# EAGLE design tlc5940 (EAGLE 5.11)
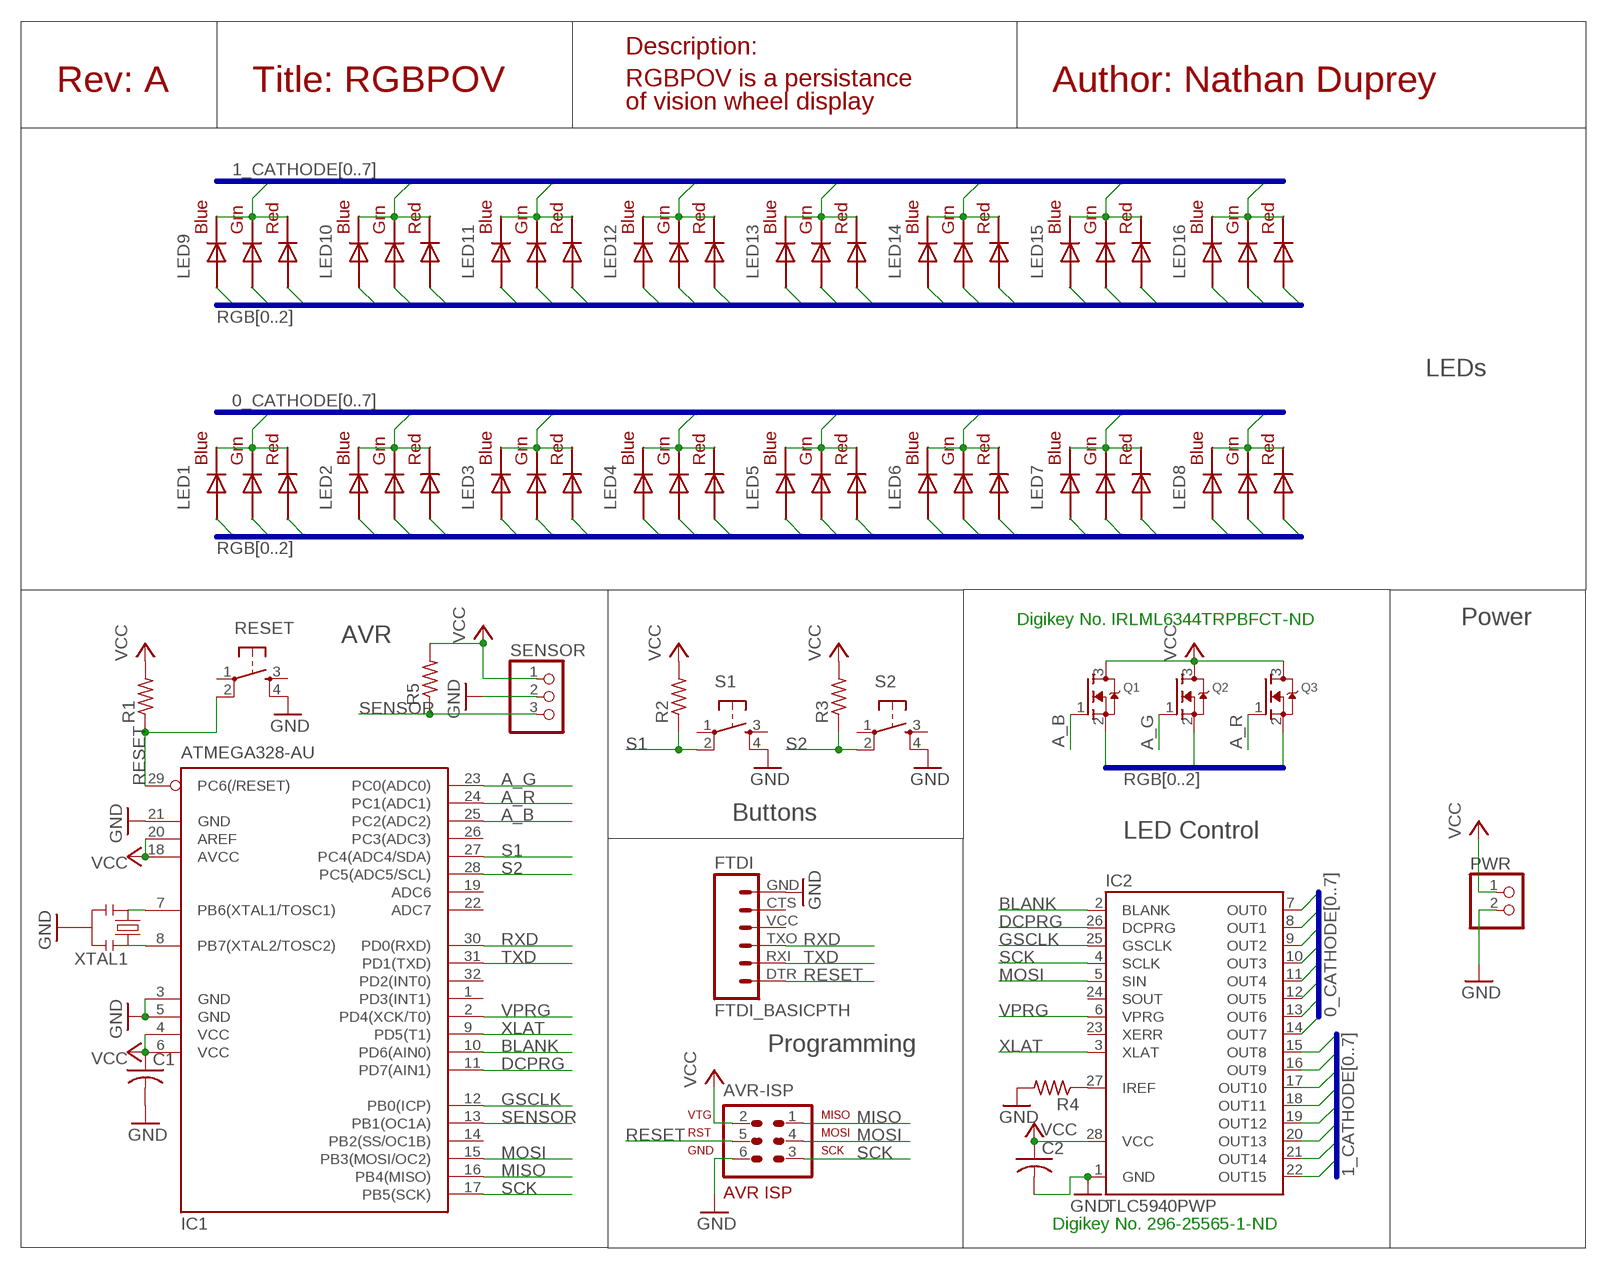
[diagram p0: schematic, sheet 1]

## Parts
AVR-ISP  AVR-ISP-6  [AVR-ISP-6]
C1  C-USC0805K  [C0805K]
C2  C-USC0805K  [C0805K]
FTDI  FTDI_BASICPTH  [FTDI_BASIC]
IC1  ATMEGA328-AU  MEGA8-AI  [TQFP32-08]
IC2  TLC5940PWP  [HTSSOP28PWP]
LED1  RGBLED5050  [RGBLED5050]
LED2  RGBLED5050  [RGBLED5050]
LED3  RGBLED5050  [RGBLED5050]
LED4  RGBLED5050  [RGBLED5050]
LED5  RGBLED5050  [RGBLED5050]
LED6  RGBLED5050  [RGBLED5050]
LED7  RGBLED5050  [RGBLED5050]
LED8  RGBLED5050  [RGBLED5050]
LED9  RGBLED5050  [RGBLED5050]
LED10  RGBLED5050  [RGBLED5050]
LED11  RGBLED5050  [RGBLED5050]
LED12  RGBLED5050  [RGBLED5050]
LED13  RGBLED5050  [RGBLED5050]
LED14  RGBLED5050  [RGBLED5050]
LED15  RGBLED5050  [RGBLED5050]
LED16  RGBLED5050  [RGBLED5050]
PWR  PINHD-1X2  [1X02]
Q1  MOSFET-NREFLOW  [SOT23]
Q2  MOSFET-NREFLOW  [SOT23]
Q3  MOSFET-NREFLOW  [SOT23]
R1  R-US_R0805  [R0805]
R2  R-US_R0805  [R0805]
R3  R-US_R0805  [R0805]
R4  R-US_R0805  [R0805]
R5  R-US_R0805  [R0805]
RESET  TAC_SWITCHPTH  [TACTILE-PTH]
S1  TAC_SWITCHPTH  [TACTILE-PTH]
S2  TAC_SWITCHPTH  [TACTILE-PTH]
SENSOR  PINHD-1X3  [1X03]
XTAL1  RESONATORPTH  [RESONATOR-PTH]

## Nets
0_CATHODE0: IC2.7(OUT0) LED1.4(BLUE_C) LED1.5(RED_C) LED1.6(GREEN_C)
0_CATHODE1: IC2.8(OUT1) LED2.4(BLUE_C) LED2.5(RED_C) LED2.6(GREEN_C)
0_CATHODE2: IC2.9(OUT2) LED3.4(BLUE_C) LED3.5(RED_C) LED3.6(GREEN_C)
0_CATHODE3: IC2.10(OUT3) LED4.4(BLUE_C) LED4.5(RED_C) LED4.6(GREEN_C)
0_CATHODE4: IC2.11(OUT4) LED5.4(BLUE_C) LED5.5(RED_C) LED5.6(GREEN_C)
0_CATHODE5: IC2.12(OUT5) LED6.4(BLUE_C) LED6.5(RED_C) LED6.6(GREEN_C)
0_CATHODE6: IC2.13(OUT6) LED7.4(BLUE_C) LED7.5(RED_C) LED7.6(GREEN_C)
0_CATHODE7: IC2.14(OUT7) LED8.4(BLUE_C) LED8.5(RED_C) LED8.6(GREEN_C)
1_CATHODE0: IC2.15(OUT8) LED9.4(BLUE_C) LED9.5(RED_C) LED9.6(GREEN_C)
1_CATHODE1: IC2.16(OUT9) LED10.4(BLUE_C) LED10.5(RED_C) LED10.6(GREEN_C)
1_CATHODE2: IC2.17(OUT10) LED11.4(BLUE_C) LED11.5(RED_C) LED11.6(GREEN_C)
1_CATHODE3: IC2.18(OUT11) LED12.4(BLUE_C) LED12.5(RED_C) LED12.6(GREEN_C)
1_CATHODE4: IC2.19(OUT12) LED13.4(BLUE_C) LED13.5(RED_C) LED13.6(GREEN_C)
1_CATHODE5: IC2.20(OUT13) LED14.4(BLUE_C) LED14.5(RED_C) LED14.6(GREEN_C)
1_CATHODE6: IC2.21(OUT14) LED15.4(BLUE_C) LED15.5(RED_C) LED15.6(GREEN_C)
1_CATHODE7: IC2.22(OUT15) LED16.4(BLUE_C) LED16.5(RED_C) LED16.6(GREEN_C)
A_B: IC1.25(PC2(ADC2)) Q1.1(G)
A_G: IC1.23(PC0(ADC0)) Q2.1(G)
A_R: IC1.24(PC1(ADC1)) Q3.1(G)
BLANK: IC1.10(PD6(AIN0)) IC2.2(BLANK)
DCPRG: IC1.11(PD7(AIN1)) IC2.26(DCPRG)
GND: AVR-ISP.6 C1.2 C2.2 FTDI.GND IC1.3(GND) IC1.5(GND) IC1.21(GND) IC2.1(GND) PWR.2 R4.2 RESET.4 S1.4 S2.4 SENSOR.2 XTAL1.2
GSCLK: IC1.12(PB0(ICP)) IC2.25(GSCLK)
MISO: AVR-ISP.1 IC1.16(PB4(MISO))
MOSI: AVR-ISP.4 IC1.15(PB3(MOSI/OC2)) IC2.5(SIN)
N$1: IC1.7(PB6(XTAL1/TOSC1)) XTAL1.1
N$2: IC1.8(PB7(XTAL2/TOSC2)) XTAL1.3
N$3: IC2.27(IREF) R4.1
RESET: AVR-ISP.5 FTDI.DTR IC1.29(PC6(/RESET)) R1.1 RESET.2
RGB0: LED1.3(BLUE_A) LED2.3(BLUE_A) LED3.3(BLUE_A) LED4.3(BLUE_A) LED5.3(BLUE_A) LED6.3(BLUE_A) LED7.3(BLUE_A) LED8.3(BLUE_A) LED9.3(BLUE_A) LED10.3(BLUE_A) LED11.3(BLUE_A) LED12.3(BLUE_A) LED13.3(BLUE_A) LED14.3(BLUE_A) LED15.3(BLUE_A) LED16.3(BLUE_A) Q1.2(S)
RGB1: LED1.1(GREEN_A) LED2.1(GREEN_A) LED3.1(GREEN_A) LED4.1(GREEN_A) LED5.1(GREEN_A) LED6.1(GREEN_A) LED7.1(GREEN_A) LED8.1(GREEN_A) LED9.1(GREEN_A) LED10.1(GREEN_A) LED11.1(GREEN_A) LED12.1(GREEN_A) LED13.1(GREEN_A) LED14.1(GREEN_A) LED15.1(GREEN_A) LED16.1(GREEN_A) Q2.2(S)
RGB2: LED1.2(RED_A) LED2.2(RED_A) LED3.2(RED_A) LED4.2(RED_A) LED5.2(RED_A) LED6.2(RED_A) LED7.2(RED_A) LED8.2(RED_A) LED9.2(RED_A) LED10.2(RED_A) LED11.2(RED_A) LED12.2(RED_A) LED13.2(RED_A) LED14.2(RED_A) LED15.2(RED_A) LED16.2(RED_A) Q3.2(S)
RXD: FTDI.TXO IC1.30(PD0(RXD))
S1: IC1.27(PC4(ADC4/SDA)) R2.1 S1.2
S2: IC1.28(PC5(ADC5/SCL)) R3.1 S2.2
SCK: AVR-ISP.3 IC1.17(PB5(SCK)) IC2.4(SCLK)
SENSOR: IC1.13(PB1(OC1A)) R5.1 SENSOR.3
TXD: FTDI.RXI IC1.31(PD1(TXD))
VCC: AVR-ISP.2 C1.1 C2.1 IC1.4(VCC) IC1.6(VCC) IC1.18(AVCC) IC1.20(AREF) IC2.28(VCC) PWR.1 Q1.3(D) Q2.3(D) Q3.3(D) R1.2 R2.2 R3.2 R5.2 SENSOR.1
VPRG: IC1.2(PD4(XCK/T0)) IC2.6(VPRG)
XLAT: IC1.9(PD5(T1)) IC2.3(XLAT)
Unconnected: FTDI.CTS FTDI.VCC IC1.1(PD3(INT1)) IC1.14(PB2(SS/OC1B)) IC1.19(ADC6) IC1.22(ADC7) IC1.26(PC3(ADC3)) IC1.32(PD2(INT0)) IC2.23(XERR) IC2.24(SOUT) RESET.1 RESET.3 S1.1 S1.3 S2.1 S2.3

## Buses
RGB[0..2]
0_CATHODE[0..7]
1_CATHODE[0..7]

## Notes on the sheet
- Description:
- Rev: A | Title: RGBPOV | RGBPOV is a persistance | Author: Nathan Duprey
- of vision wheel display
- LEDs
- Digikey No. IRLML6344TRPBFCT-ND | Power
- AVR
- Buttons
- LED Control
- Programming
- Digikey No. 296-25565-1-ND

## Library data of the parts
AVR-ISP = avr-6:AVR-ISP-6: AVR ISP-6 Serial Programming Header
C1 C2 = adafruit:C-US: CAPACITOR, American symbol
FTDI = SparkFun:FTDI_BASIC: FTDI Basic: 3.3V and 5V
IC1 = atmel:MEGA8: MICROCONTROLLER 8 Kbytes FLASH, 1 kbytes SRAM, 512 bytes EEPROM, USART, 6-channel 10 bit ADC, 2-channel 8 bit ADC Pin compatible with Atmega48, ATMega88, ATMega168 Source: avr.lbr; MPN: ATMEGA8-16AU; OC_FARNELL: 9171371; OC_NEWARK: 73M8863
IC2 = texas:TLC5940
LED1-LED16 = adafruit:RGBLED: For 5050 RGB LEDs, the order of the LEDs may vary from one manufacturer to another!
PWR = pinhead:PINHD-1X2: PIN HEADER
Q1-Q3 = adafruit:MOSFET-N: N-Channel Mosfet 2N7002E - 60V 260mA SOT23 [Digikey: 2N7002ET1GOSTR-ND] - REEL BSH103 - 30V 850mA SOT23 [Digikey: 568-5013-1-ND]
R1-R5 = adafruit:R-US_: RESISTOR, American symbol
RESET S1 S2 = SparkFun:TAC_SWITCH: Momentary Switch Button commonly used for reset or general input. Spark Fun Electronics SKU : COM-00097
SENSOR = pinhead:PINHD-1X3: PIN HEADER
XTAL1 = SparkFun:RESONATOR: Resonator Small SMD resonator. This is the itty bitty 10/20MHz resonators with built in caps. CSTCE10M0G55 and CSTCE20M0V53. Footprint has been reviewed closely but hasn't been tested yet.

## Board
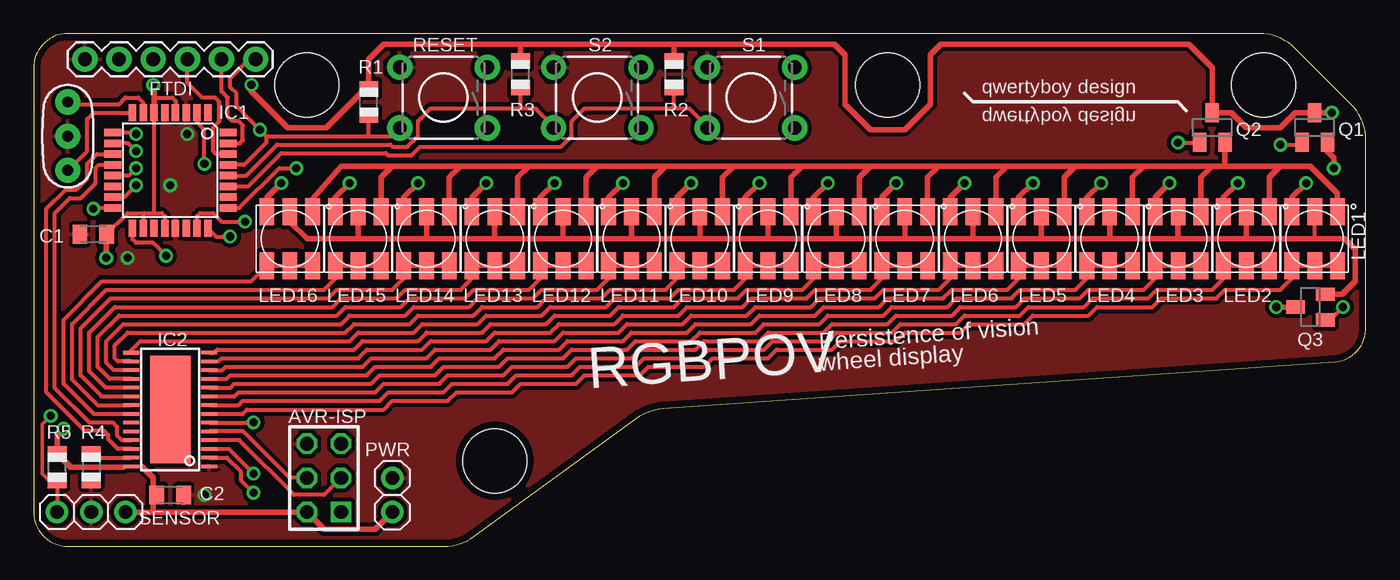
[diagram p1: board, top side]
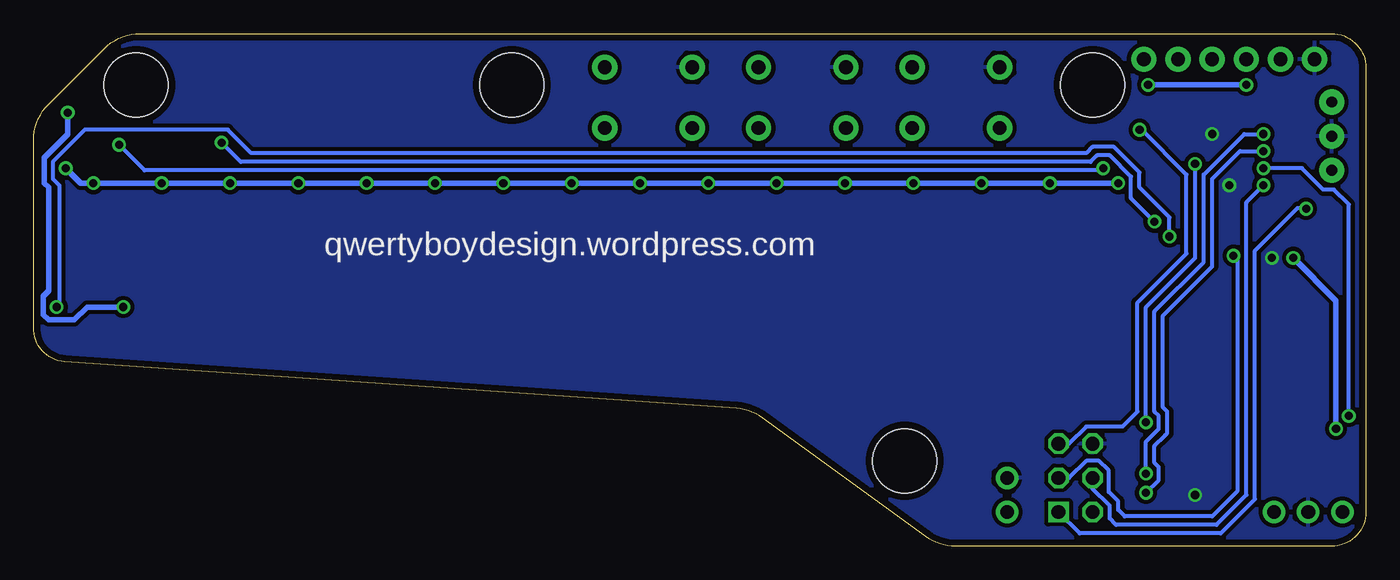
[diagram p2: board, bottom side, seen from below]

Size 99.06 x 38.1 mm. Coordinates in mm from the lower left corner, seen from the top.
Outline: 30.51,0 arc36 32.75,0.73 44.84,9.52 arc-32 46.81,10.24 96.79,13.72 arc86 99.06,16.25 99.06,30.17 arc45 97.94,32.87 93.83,36.98 arc45 91.13,38.1 2.54,38.1 arc90 0,35.56 0,2.54 arc90 2.54,0 30.51,0
Copper layers (1*16): Top 0.0356mm / dielectric 1.5011mm / Bottom 0.0356mm
Design rules "batch_pcb *": minimum track width 9mil, minimum drill 20mil, track to track 9mil, track to pad 9mil, pad to pad 9mil, via to via 9mil, smd to smd 9mil, copper to edge 20mil, drill to drill 9mil, minimum pad ring 8mil, minimum via ring 8mil, stop-mask expansion 4mil, vias tented up to drill 24mil, thermal gap 10mil
Holes 4.76 mm at 91.44,34.29 63.5,34.29 20.32,34.29 34.29,6.35
tRestrict: 19 lines
bRestrict: 15 lines

### Footprints (pad centres in the part's own frame; a part is rotated, then mirrored left to right if it is on the bottom)
AVR-ISP-6 = drill 1.016 square: 1 -2.54,-1.27 | drill 1.016 octagon: 2 -2.54,1.27; 3 0,-1.27; 4 0,1.27; 5 2.54,-1.27; 6 2.54,1.27
C0805K = smd 1.1 x 1.4: 1 -1,0; 2 1,0
FTDI_BASIC = drill 1.016 pad 1.88 round: CTS 10.16,0; DTR 0,0; GND 12.7,0; RXI 2.54,0; TXO 5.08,0; VCC 7.62,0
TQFP32-08 = smd 1.27 x 0.559: 1 -4.293,2.8; 2 -4.293,2; 3 -4.293,1.2; 4 -4.293,0.4; 5 -4.293,-0.4; 6 -4.293,-1.2; 7 -4.293,-2; 8 -4.293,-2.8; 17 4.293,-2.8; 18 4.293,-2; 19 4.293,-1.2; 20 4.293,-0.4; 21 4.293,0.4; 22 4.293,1.2; 23 4.293,2; 24 4.293,2.8 | smd 0.559 x 1.27: 9 -2.8,-4.293; 10 -2,-4.293; 11 -1.2,-4.293; 12 -0.4,-4.293; 13 0.4,-4.293; 14 1.2,-4.293; 15 2,-4.293; 16 2.8,-4.293; 25 2.8,4.293; 26 2,4.293; 27 1.2,4.293; 28 0.4,4.293; 29 -0.4,4.293; 30 -1.2,4.293; 31 -2,4.293; 32 -2.8,4.293
HTSSOP28PWP = smd 0.27 x 1.2: 1 -4.225,-2.901; 2 -3.575,-2.9; 3 -2.925,-2.9; 4 -2.275,-2.9; 5 -1.625,-2.9; 6 -0.975,-2.9; 7 -0.325,-2.9; 8 0.325,-2.9; 9 0.975,-2.9; 10 1.625,-2.9; 11 2.275,-2.9; 12 2.925,-2.9; 13 3.575,-2.9; 14 4.227,-2.9; 15 4.225,2.9; 16 3.575,2.9; 17 2.925,2.9; 18 2.275,2.9; 19 1.625,2.9; 20 0.975,2.9; 21 0.325,2.9; 22 -0.325,2.9; 23 -0.975,2.9; 24 -1.625,2.9; 25 -2.275,2.9; 26 -2.925,2.9; 27 -3.575,2.9; 28 -4.226,2.901 | smd 8 x 3: EXP 0,0
RGBLED5050 = smd 2 x 1.1: 1 -2,1.7; 2 -2,0; 3 -2,-1.7; 4 2,-1.7; 5 2,0; 6 2,1.7
1X02 = drill 1.016 pad 1.676 round: 1 -1.27,0; 2 1.27,0
SOT23 = smd 1 x 1.4: 1 -0.95,-1.1; 2 0.95,-1.1; 3 0,1.1
R0805 = smd 1.1 x 1.4: 1 -1,0; 2 1,0
TACTILE-PTH = drill 1.016 pad 1.88 round: 1 -3.251,2.261; 2 3.251,2.261; 3 -3.251,-2.261; 4 3.251,-2.261
1X03 = drill 1.016 pad 1.676 round: 1 -2.54,0; 2 0,0; 3 2.54,0
RESONATOR-PTH = drill 0.8 pad 1.88 round: 1 -2.54,0; 2 0,0; 3 2.54,0

### Placement (x,y rotation side)
AVR-ISP  21.59,5.08 90 top
C1  4.45,23.18 180 top
C2  10.16,3.81 0 top
FTDI  16.51,36.2 180 top
IC1  10.16,27.94 270 top
IC2  10.16,10.16 90 top
LED1  95.25,22.86 270 top
LED2  90.17,22.86 270 top
LED3  85.09,22.86 270 top
LED4  80.01,22.86 270 top
LED5  74.93,22.86 270 top
LED6  69.85,22.86 270 top
LED7  64.77,22.86 270 top
LED8  59.69,22.86 270 top
LED9  54.61,22.86 270 top
LED10  49.53,22.86 270 top
LED11  44.45,22.86 270 top
LED12  39.37,22.86 270 top
LED13  34.29,22.86 270 top
LED14  29.21,22.86 270 top
LED15  24.13,22.86 270 top
LED16  19.05,22.86 270 top
PWR  26.67,3.81 90 top
Q1  95.25,31.11 0 top
Q2  87.63,31.11 0 top
Q3  94.93,17.78 90 top
R1  24.92,33.02 90 top
R2  47.62,35.08 90 top
R3  36.2,35.08 90 top
R4  4.29,5.87 270 top
R5  1.75,5.87 90 top
RESET  30.48,33.34 180 top
S1  53.34,33.34 180 top
S2  41.91,33.34 180 top
SENSOR  4.29,2.54 180 top
U$1  [QWERTYBOY_DESIGN_LOGO]  77.47,33.02 0 bottom
XTAL1  2.54,30.48 270 top

### Tracks (layer width: path | path; a pad name or v marks a point on that pad's centre or on a via)
0_CATHODE0
  Top 0.305: IC2.7 15.55,9.84 15.88,10.16 26.04,10.16 26.67,10.79 30.8,10.79 31.43,11.43 35.56,11.43 36.2,12.06 40.32,12.06 40.96,12.7 45.09,12.7 45.72,13.34 49.85,13.34 50.48,13.97 54.61,13.97 55.24,14.61 59.37,14.61 60.01,15.24 64.14,15.24 64.77,15.88 68.9,15.88 69.53,16.51 73.66,16.51 74.3,17.14 78.42,17.14 79.06,17.78 83.19,17.78 83.82,18.41 87.95,18.41 88.58,19.05 92.71,19.05 93.98,20.32 93.98,20.43 LED1.4 LED1.5 LED1.6
0_CATHODE1
  Top 0.305: IC2.8 15.25,10.48 15.56,10.79 25.72,10.79 26.35,11.43 30.48,11.43 31.11,12.06 35.24,12.06 35.88,12.7 40.01,12.7 40.64,13.34 44.77,13.34 45.4,13.97 49.53,13.97 50.16,14.61 54.29,14.61 54.93,15.24 59.05,15.24 59.69,15.88 63.82,15.88 64.45,16.51 68.58,16.51 69.22,17.14 73.34,17.14 73.98,17.78 78.11,17.78 78.74,18.41 82.87,18.41 83.5,19.05 87.63,19.05 88.9,20.32 88.9,20.43 LED2.4 LED2.5 LED2.6
0_CATHODE2
  Top 0.305: IC2.9 14.95,11.13 15.24,11.43 25.4,11.43 26.04,12.06 30.16,12.06 30.8,12.7 34.92,12.7 35.56,13.34 39.69,13.34 40.32,13.97 44.45,13.97 45.09,14.61 49.21,14.61 49.85,15.24 53.98,15.24 54.61,15.88 58.74,15.88 59.37,16.51 63.5,16.51 64.14,17.14 68.26,17.14 68.9,17.78 73.03,17.78 73.66,18.41 77.79,18.41 78.42,19.05 82.55,19.05 83.82,20.32 83.82,20.43 LED3.4 LED3.5 LED3.6
0_CATHODE3
  Top 0.305: IC2.10 14.64,11.79 14.92,12.06 25.08,12.06 25.72,12.7 29.84,12.7 30.48,13.34 34.61,13.34 35.24,13.97 39.37,13.97 40.01,14.61 44.13,14.61 44.77,15.24 48.9,15.24 49.53,15.88 53.66,15.88 54.29,16.51 58.42,16.51 59.05,17.14 63.18,17.14 63.82,17.78 67.94,17.78 68.58,18.41 72.71,18.41 73.34,19.05 77.47,19.05 78.74,20.32 78.74,20.43 LED4.4 LED4.5 LED4.6
0_CATHODE4
  Top 0.305: IC2.11 14.34,12.44 14.61,12.7 24.77,12.7 25.4,13.34 29.53,13.34 30.16,13.97 34.29,13.97 34.92,14.61 39.05,14.61 39.69,15.24 43.81,15.24 44.45,15.88 48.58,15.88 49.21,16.51 53.34,16.51 53.98,17.14 58.1,17.14 58.74,17.78 62.87,17.78 63.5,18.41 67.63,18.41 68.26,19.05 72.39,19.05 73.66,20.32 73.66,20.43 LED5.4 LED5.5 LED5.6
0_CATHODE5
  Top 0.305: IC2.12 14.04,13.09 14.29,13.34 24.45,13.34 25.08,13.97 29.21,13.97 29.84,14.61 33.97,14.61 34.61,15.24 38.73,15.24 39.37,15.88 43.5,15.88 44.13,16.51 48.26,16.51 48.9,17.14 53.02,17.14 53.66,17.78 57.78,17.78 58.42,18.41 62.55,18.41 63.18,19.05 67.31,19.05 68.58,20.32 68.58,20.43 LED6.4 LED6.5 LED6.6
0_CATHODE6
  Top 0.305: IC2.13 13.73,13.73 13.97,13.97 24.13,13.97 24.77,14.61 28.89,14.61 29.53,15.24 33.66,15.24 34.29,15.88 38.42,15.88 39.05,16.51 43.18,16.51 43.81,17.14 47.94,17.14 48.58,17.78 52.7,17.78 53.34,18.41 57.47,18.41 58.1,19.05 62.23,19.05 63.5,20.32 63.5,20.43 LED7.4 LED7.5 LED7.6
0_CATHODE7
  Top 0.305: IC2.14 13.43,14.39 13.65,14.61 23.81,14.61 24.45,15.24 28.57,15.24 29.21,15.88 33.34,15.88 33.97,16.51 38.1,16.51 38.73,17.14 42.86,17.14 43.5,17.78 47.62,17.78 48.26,18.41 52.39,18.41 53.02,19.05 57.15,19.05 58.42,20.32 58.42,20.43 LED8.4 LED8.5 LED8.6
1_CATHODE0
  Top 0.305: IC2.15 7.26,14.56 7.94,15.24 23.5,15.24 24.13,15.88 28.26,15.88 28.89,16.51 33.02,16.51 33.66,17.14 37.78,17.14 38.42,17.78 42.55,17.78 43.18,18.41 47.31,18.41 47.94,19.05 52.07,19.05 53.34,20.32 53.34,20.43 LED9.4 LED9.5 LED9.6
1_CATHODE1
  Top 0.305: IC2.16 6.27,13.73 6.03,13.97 6.03,14.92 6.99,15.88 23.18,15.88 23.81,16.51 27.94,16.51 28.57,17.14 32.7,17.14 33.34,17.78 37.47,17.78 38.1,18.41 42.23,18.41 42.86,19.05 46.99,19.05 48.26,20.32 48.26,20.43 LED10.4 LED10.5 LED10.6
1_CATHODE2
  Top 0.305: IC2.17 5.96,13.09 5.4,13.65 5.4,15.24 6.67,16.51 22.86,16.51 23.5,17.14 27.62,17.14 28.26,17.78 32.38,17.78 33.02,18.41 37.15,18.41 37.78,19.05 41.91,19.05 43.18,20.32 43.18,20.43 LED11.4 LED11.5 LED11.6
1_CATHODE3
  Top 0.305: IC2.18 5.66,12.44 4.76,13.34 4.76,15.56 6.35,17.14 22.54,17.14 23.18,17.78 27.3,17.78 27.94,18.41 32.07,18.41 32.7,19.05 36.83,19.05 38.1,20.32 38.1,20.43 LED12.4 LED12.5 LED12.6
1_CATHODE4
  Top 0.305: IC2.19 5.36,11.79 4.13,13.02 4.13,15.88 6.03,17.78 22.23,17.78 22.86,18.41 26.99,18.41 27.62,19.05 31.75,19.05 33.02,20.32 33.02,20.43 LED13.4 LED13.5 LED13.6
1_CATHODE5
  Top 0.305: IC2.20 5.06,11.13 3.49,12.7 3.49,16.19 5.71,18.41 21.91,18.41 22.54,19.05 26.67,19.05 27.94,20.32 27.94,20.43 LED14.4 LED14.5 LED14.6
1_CATHODE6
  Top 0.305: IC2.21 4.75,10.48 2.86,12.38 2.86,16.51 5.4,19.05 21.59,19.05 22.86,20.32 22.86,20.43 LED15.4 LED15.5 LED15.6
1_CATHODE7
  Top 0.305: IC2.22 4.45,9.84 2.22,12.06 2.22,16.83 5.08,19.68 16.18,19.68 LED16.4 LED16.5 LED16.6
A_B  (via drill 0.6 pad 1.02)
  Top 0.305: IC1.25 15.3,25.14 18.26,28.1 v19.53,28.1 | v92.71,29.84 94.13,29.84 Q1.1
  Bottom 0.305: v92.71,29.84 90.81,27.94 19.68,27.94 v19.53,28.1 | v19.53,28.1
A_G  (via drill 0.6 pad 1.02)
  Top 0.305: IC1.23 12.16,24.54 12.38,24.77 13.34,24.77 13.65,24.45 13.97,24.13 v15.72,24.13 | v85.09,30 86.67,30 Q2.1
  Bottom 0.305: 83.66,28.57 20.48,28.57 20,29.05 19.05,29.05 17.46,27.46 17.46,25.88 v15.72,24.13 | v15.72,24.13 | 83.66,28.57 | 83.66,28.57 v85.09,30
A_R  (via drill 0.6 pad 1.02)
  Top 0.305: v14.61,23.02 13.59,23.02 IC1.24 | Q3.1 96.41,16.83 v97.36,17.78
  Bottom 0.305: v14.61,23.02 14.61,24.45 16.83,26.67 16.83,27.78 18.73,29.69 20.32,29.69 20.8,29.21 82.87,29.21 84.61,30.96 95.25,30.96 97.63,28.57 97.63,27.3 97.16,26.83 97.16,17.98 v97.36,17.78
BLANK  (via drill 0.6 pad 1.02)
  Top 0.305: IC2.2 14.37,6.58 15.4,5.56 15.4,4.92 v16.35,3.97 | IC1.10 7.05,29.94 v7.62,29.37
  Bottom 0.305: v16.35,3.97 15.4,4.92 15.4,5.87 15.72,6.19 15.72,7.46 14.92,8.26 | 14.92,8.26 | 14.92,8.26 14.76,8.41 14.76,10 15.08,10.32 15.08,17.14 11.43,20.8 11.43,27.3 9.37,29.37 v7.62,29.37
DCPRG
  Top 0.305: IC1.11 4.69,29.14 3.97,28.42 3.97,27.3 3.17,26.51 2.38,26.51 0.95,25.08 0.95,11.43 3.81,8.57 5.24,8.57 5.56,8.26 5.56,7.94 6.26,7.24 IC2.26
GND  (via drill 0.6 pad 1.02)
  other vias: 12.7,3.81 10.16,26.83 11.43,30.64 6.99,21.43
  pour Top (isolate 0.305): 0,0 99.06,0 99.06,38.1 0,38.1
  pour Bottom (isolate 0.305): 0,0 99.06,0 99.06,38.1 0,38.1
GSCLK
  Top 0.305: IC1.12 4.84,28.34 4.6,28.1 4.6,26.99 3.49,25.88 2.7,25.88 1.59,24.77 1.59,11.75 4.13,9.21 5.87,9.21 6.19,8.89 6.19,8.26 6.56,7.88 IC2.25
MISO  (via drill 0.6 pad 1.02)
  Top 0.305: IC1.16 4.5,25.14 v4.45,25.08
  Bottom 0.305: AVR-ISP.1 21.27,0.95 10.79,0.95 8.26,3.49 8.26,21.96 5.08,25.14 4.5,25.14 v4.45,25.08
MOSI  (via drill 0.6 pad 1.02)
  Top 0.305: IC2.5 15.6,8.54 19.05,5.08 AVR-ISP.4 | IC1.15 6.73,25.94 v7.62,26.83
  Bottom 0.305: AVR-ISP.4 20.32,4.29 19.05,3.02 19.05,2.06 18.57,1.59 11.11,1.59 8.89,3.81 8.89,25.56 v7.62,26.83
N$1
  Top 0.305: IC1.7 8.16,32.96 7.78,33.34 6.83,33.34 6.35,32.86 2.7,32.86 XTAL1.1
N$2
  Top 0.305: XTAL1.3 3.97,29.37 3.97,31.75 4.45,32.23 IC1.8
N$3
  Top 0.305: IC2.27 4.58,6.58 R4.1
RESET  (via drill 0.6 pad 1.02)
  Top 0.305: IC1.29 15.64,28.34 17.3,30 17.3,30.48 | 24.92,30.48 26.63,30.48 RESET.2 | 24.92,30.48 R1.1 | FTDI.DTR 16.03,36.2 14.61,34.77 14.61,34.13 15.08,33.66 15.08,32.7 16.19,31.59 | 16.19,31.59 | 16.19,31.59 v16.83,30.96 17.3,30.48 | 17.3,30.48 24.92,30.48
  Bottom 0.305: AVR-ISP.5 22.07,7.62 20.8,8.89 18.1,8.89 16.99,10 16.99,18.1 13.34,21.75 13.34,27.62 16.67,30.96 v16.83,30.96
RGB0  (via drill 0.6 pad 1.02)
  Top 0.305: Q1.2
  Top 0.406: LED16.3 17.35,25.92 v18.41,26.99 | LED15.3 22.43,25.92 v23.5,26.99 | LED14.3 27.51,25.92 v28.57,26.99 | LED13.3 32.59,25.92 v33.66,26.99 | LED12.3 37.67,25.92 v38.73,26.99 | LED11.3 42.75,25.92 v43.81,26.99 | LED10.3 47.83,25.92 v48.9,26.99 | LED9.3 52.91,25.92 v53.98,26.99 | LED8.3 57.99,25.92 v59.05,26.99 | LED7.3 63.07,25.92 v64.14,26.99 | LED6.3 68.15,25.92 v69.22,26.99 | LED5.3 73.23,25.92 v74.3,26.99 | LED4.3 78.31,25.92 v79.38,26.99 | LED3.3 83.39,25.92 v84.45,26.99 | LED2.3 88.47,25.92 v89.53,26.99 | LED1.3 93.55,25.92 v94.61,26.99 | v96.68,28.1 96.68,28.89 96.2,29.37 Q1.2
  Bottom 0.406: v18.41,26.99 v23.5,26.99 v28.57,26.99 v33.66,26.99 v38.73,26.99 v43.81,26.99 v48.9,26.99 v53.98,26.99 v59.05,26.99 v64.14,26.99 v69.22,26.99 v74.3,26.99 v79.38,26.99 v84.45,26.99 v89.53,26.99 v94.61,26.99 95.57,26.99 v96.68,28.1
RGB1
  Top 0.305: LED16.1 20.75,25.83
  Top 0.406: 20.75,25.83 22.86,28.26 26.67,28.26 | 26.67,28.26 31.75,28.26 | 31.75,28.26 36.83,28.26 | 36.83,28.26 41.91,28.26 | 41.91,28.26 46.99,28.26 | 46.99,28.26 52.07,28.26 | 52.07,28.26 57.15,28.26 | 57.15,28.26 62.23,28.26 | 62.23,28.26 67.31,28.26 | 67.31,28.26 72.39,28.26 | 72.39,28.26 77.47,28.26 | 77.47,28.26 82.55,28.26 | 82.55,28.26 87.63,28.26 | 87.63,28.26 88.58,28.26 | 88.58,28.26 92.71,28.26 | 92.71,28.26 94.93,28.26 96.95,26.24 LED1.1 | LED15.1 25.83,27.42 26.67,28.26 | LED14.1 30.91,27.42 31.75,28.26 | LED13.1 35.99,27.42 36.83,28.26 | LED11.1 46.15,27.42 46.99,28.26 | LED10.1 51.23,27.42 52.07,28.26 | LED9.1 56.31,27.42 57.15,28.26 | LED8.1 61.39,27.42 62.23,28.26 | LED7.1 66.47,27.42 67.31,28.26 | LED6.1 71.55,27.42 72.39,28.26 | LED5.1 76.63,27.42 77.47,28.26 | LED4.1 81.71,27.42 82.55,28.26 | LED12.1 41.07,27.42 41.91,28.26 | LED3.1 86.79,27.42 87.63,28.26 | LED2.1 91.87,27.42 92.71,28.26 | Q2.2 88.58,28.26
RGB2
  Top 0.305: 95.25,24.13 95.25,23.02 95.41,22.86
  Top 0.406: LED16.2 19.05,24.13 20.32,22.86 24.13,22.86 | 24.13,22.86 29.21,22.86 | 29.21,22.86 34.29,22.86 | 34.29,22.86 39.37,22.86 | 39.37,22.86 44.45,22.86 | 44.45,22.86 49.53,22.86 | 49.53,22.86 54.61,22.86 | 54.61,22.86 59.69,22.86 | 59.69,22.86 64.77,22.86 | 64.77,22.86 69.85,22.86 | 69.85,22.86 74.93,22.86 | 74.93,22.86 80.01,22.86 | 80.01,22.86 85.09,22.86 | 85.09,22.86 90.17,22.86 | 95.25,24.13 LED1.2 | 90.17,22.86 LED2.2 | 85.09,22.86 LED3.2 | 80.01,22.86 LED4.2 | 74.93,22.86 LED5.2 | 69.85,22.86 LED6.2 | 64.77,22.86 LED7.2 | 59.69,22.86 LED8.2 | 54.61,22.86 LED9.2 | 49.53,22.86 LED10.2 | 44.45,22.86 LED11.2 | 39.37,22.86 LED12.2 | 34.29,22.86 LED13.2 | 29.21,22.86 LED14.2 | 24.13,22.86 LED15.2 | 90.17,22.86 95.41,22.86 97.47,22.86 98.27,22.07 98.27,19.68 97.31,18.73 Q3.2
RXD
  Top 0.305: IC1.30 13.56,29.14 13.34,29.37 13.34,31.11 13.81,31.59 13.81,33.02 13.49,33.34 12.54,33.34 11.43,34.45 FTDI.TXO
S1
  Top 0.305: S1.2 50.09,31.19 48.74,32.54 47.62,32.54 | 47.62,32.54 40.96,32.54 40.01,31.59 | 40.01,31.59 | 40.01,31.59 40.01,30.48 39.21,29.69 28.73,29.69 28.1,29.05 26.35,29.05 26.19,29.21 18.41,29.21 15.95,26.74 IC1.27 | 47.62,32.54 R2.1
S2
  Top 0.305: S2.2 38.66,31.19 37.47,32.38 | 37.47,32.38 | 37.47,32.38 37.31,32.54 36.2,32.54 | 36.2,32.54 29.53,32.54 28.73,31.75 | 28.73,31.75 | 28.73,31.75 28.57,31.59 28.57,30.48 27.78,29.69 26.67,29.69 26.51,29.84 18.1,29.84 15.79,27.54 IC1.28 | 36.2,32.54 R3.1
SCK  (via drill 0.6 pad 1.02)
  Top 0.305: IC2.4 15.29,7.88 19.37,3.81 21.59,3.81 AVR-ISP.3 | IC1.17 7.36,22.8 7.62,22.54 8.89,22.54 v9.84,21.59
  Bottom 0.305: v9.84,21.59 9.53,21.27 9.53,4.13 11.43,2.22 17.94,2.22 18.41,2.7 18.41,3.33 19.13,4.05 19.13,5.64 19.84,6.35 20.8,6.35 22.07,5.08 AVR-ISP.3
SENSOR  (via drill 0.6 pad 1.02)
  Top 0.254: R5.1 1.16,4.87 0.64,5.4 0.64,9.05 v1.27,9.68
  Top 0.305: R5.1 SENSOR.3 | IC1.13 7.06,27.54 v7.62,28.1
  Bottom 0.305: v7.62,28.1 4.76,28.1 3.17,26.51 2.38,26.51 1.27,25.4 v1.27,9.68
TXD
  Top 0.305: IC1.31 15.34,29.94 15.56,30.16 15.56,31.27 15.24,31.59 14.76,31.59 14.45,31.91 14.45,33.34 13.97,33.81 FTDI.RXI
VCC  (via drill 0.6 pad 1.02)
  Top 0.305: 8.04,5.93 IC2.28 6.73,5.93 6.67,5.87 | 8.89,4.08 C2.1 | IC1.18 8.16,24.67 8.26,24.77 | IC1.20 9.76,24.53 9.53,24.77 8.89,24.77 | 8.26,24.77 8.89,24.77 | C1.1 5.45,23.23 6.99,24.77 8.26,24.77 | IC1.4 10.56,33.1 10.32,33.34 8.96,33.34 | IC1.6 8.96,24.84 8.89,24.77 | 26.51,37.31
  Top 0.406: 8.04,5.93 8.89,5.08 8.89,4.08 | 36.2,37.31 26.51,37.31 26.04,37.31 24.92,36.2 R1.2 24.88,33.97 24.61,33.97 21.75,31.11 18.89,31.11 16.19,33.81 v16.19,34.29 | 36.2,37.31 R3.2 | 36.2,37.31 47.62,37.31 | 47.62,37.31 R2.2 | v92.39,17.78 Q3.3 | v96.52,32.23 95.26,32.23 Q1.3 93.81,32.22 92.71,31.11 90.17,31.11 89.06,32.23 87.64,32.23 Q2.3 87.63,35.56 85.88,37.31 67.47,37.31 66.67,36.51 66.67,32.86 66.52,32.7 | 6.67,5.87 2.75,5.87 R5.2 1.75,8.26 v2.22,8.73 | PWR.1 25.4,1.27 21.59,1.27 AVR-ISP.2 8.89,2.54 | C2.1 8.89,3.54 8.89,2.54 | v5.4,21.43 5.4,23.13 C1.1 | 8.89,2.54 SENSOR.1 | IC1.6 8.96,33.34 8.96,34.22 v8.89,34.29 | 47.62,37.31 59.53,37.31 60.33,36.51 60.33,32.86 62.23,30.96 64.77,30.96 66.52,32.7 | 66.52,32.7
  Bottom 0.406: v92.39,17.78 95.09,17.78 96.04,16.83 97.94,16.83 98.33,17.22 98.33,18.59 97.95,18.97 97.95,26.67 98.27,26.99 98.27,28.89 96.52,30.64 v96.52,32.23 | v2.22,8.73 2.22,18.26 v5.4,21.43 | v8.89,34.29 v16.19,34.29
VPRG  (via drill 0.6 pad 1.02)
  Top 0.305: IC2.6 16.33,9.19 v16.35,9.21 | IC1.2 12.16,31.5 12.7,30.96 v12.7,28.42
  Bottom 0.305: v16.35,9.21 16.35,17.78 12.7,21.43 v12.7,28.42
XLAT  (via drill 0.6 pad 1.02)
  Top 0.305: IC2.3 14.51,7.24 v16.35,5.4 | IC1.9 7.52,30.74 v7.62,30.64
  Bottom 0.305: v16.35,5.4 16.35,7.78 15.4,8.73 15.4,9.68 15.72,10 15.72,17.46 12.06,21.11 12.06,27.62 9.05,30.64 v7.62,30.64

### Text on the board
tNames: Persistence of vision | wheel display | RGBPOV
bNames: qwertyboydesign.wordpress.com